# EAGLE design driver (EAGLE 6.5.0)
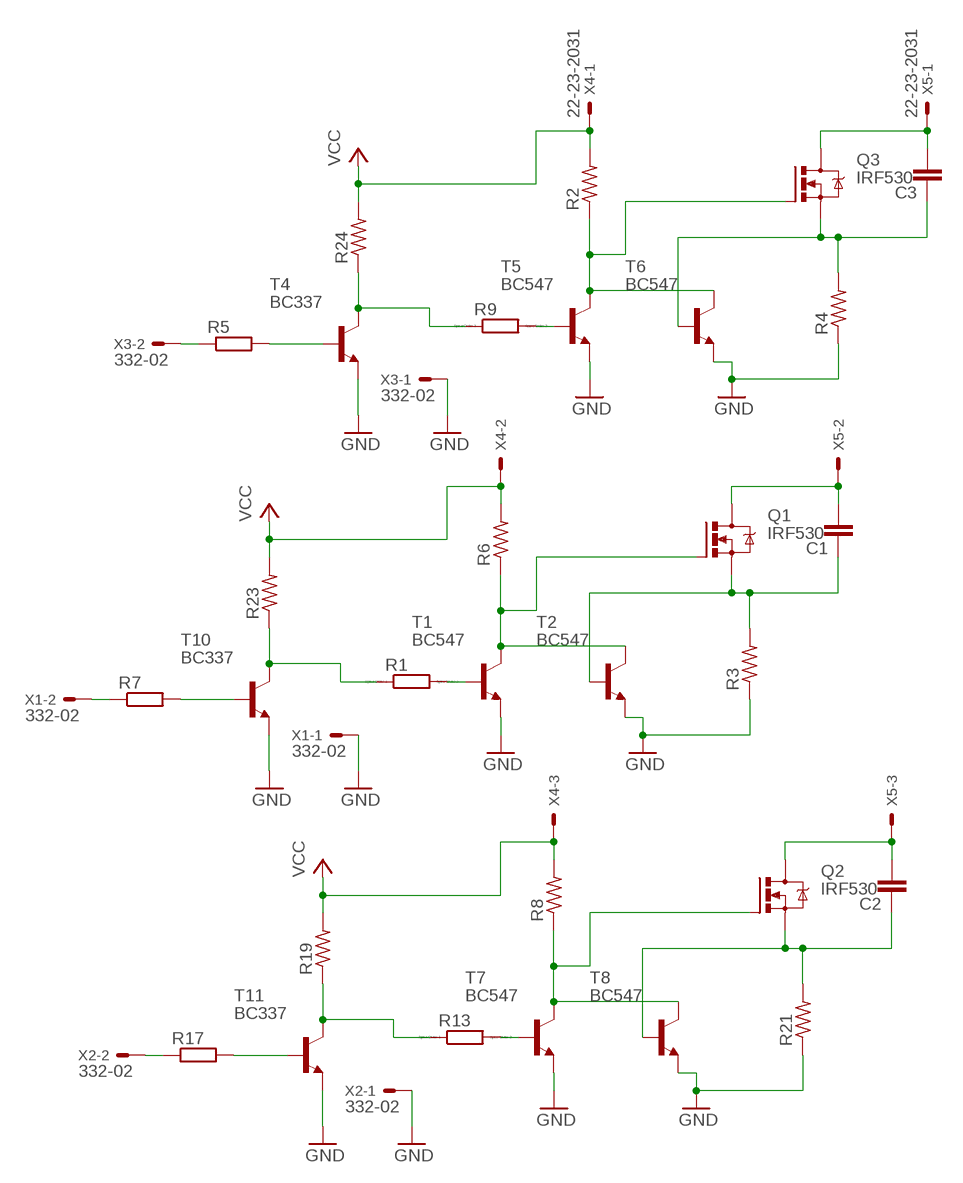
[diagram p0: schematic, sheet 1]

## Parts
C1  C-EU025-025X050  [C025-025X050]
C2  C-EU025-025X050  [C025-025X050]
C3  C-EU025-025X050  [C025-025X050]
Q1  IRF530  [TO220BV]
Q2  IRF530  [TO220BV]
Q3  IRF530  [TO220BV]
R1  R0204/7  [0204/7]
R2  R-US_0309/10  [0309/10]
R3  R-US_0817/22  [P0817/22]
R4  R-US_0817/22  [P0817/22]
R5  R-EU_0204/7  [0204/7]
R6  R-US_0309/10  [0309/10]
R7  R-EU_0204/7  [0204/7]
R8  R-US_0309/10  [0309/10]
R9  R0204/7  [0204/7]
R13  R0204/7  [0204/7]
R17  R-EU_0204/7  [0204/7]
R19  R-US_0309/10  [0309/10]
R21  R-US_0817/22  [P0817/22]
R23  R-US_0309/10  [0309/10]
R24  R-US_0309/10  [0309/10]
T1  BC547  [TO92]
T2  BC547  [TO92]
T4  BC337  [TO92]
T5  BC547  [TO92]
T6  BC547  [TO92]
T7  BC547  [TO92]
T8  BC547  [TO92]
T10  BC337  [TO92]
T11  BC337  [TO92]
X1  332-02  [332-02]
X2  332-02  [332-02]
X3  332-02  [332-02]
X4  22-23-2031  [22-23-2031]
X5  22-23-2031  [22-23-2031]

## Nets
GND: R3.1 R4.1 R21.1 T1.1(E) T2.1(E) T4.1(E) T5.1(E) T6.1(E) T7.1(E) T8.1(E) T10.1(E) T11.1(E) X1.1 X2.1 X3.1
N$1: R1.2 T1.2(B)
N$2: Q1.G R6.1 T1.3(C) T2.3(C)
N$3: C1.2 Q1.D X5.2
N$4: R5.2 T4.2(B)
N$5: C1.1 Q1.S R3.2 T2.2(B)
N$6: R7.2 T10.2(B)
N$7: R9.1 R24.1 T4.3(C)
N$8: R5.1 X3.2
N$9: R1.1 R23.1 T10.3(C)
N$10: R7.1 X1.2
N$11: R13.2 T7.2(B)
N$12: R9.2 T5.2(B)
N$13: Q3.G R2.1 T5.3(C) T6.3(C)
N$14: C3.2 Q3.D X5.1
N$15: C3.1 Q3.S R4.2 T6.2(B)
N$16: Q2.G R8.1 T7.3(C) T8.3(C)
N$17: C2.2 Q2.D X5.3
N$18: C2.1 Q2.S R21.2 T8.2(B)
N$19: R17.2 T11.2(B)
N$20: R13.1 R19.1 T11.3(C)
N$21: R17.1 X2.2
VCC: R2.2 R6.2 R8.2 R19.2 R23.2 R24.2 X4.1 X4.2 X4.3

## Library data of the parts
C1-C3 = rcl:C-EU: CAPACITOR, European symbol
Q1-Q3 = transistor-power:IRF530: HEXFET Power MOSFET
R1 R9 R13 = eagle-ltspice:R: RESISTOR, European symbol; SPICEMODEL: NONE; SPICEPREFIX: R
R2-R4 R6 R8 R19 R21 R23 R24 = resistor:R-US_: RESISTOR, American symbol
R5 R7 R17 = rcl:R-EU_: RESISTOR, European symbol
T1 T2 T5-T8 = transistor:BC547: NPN TRANSISTOR
T4 T10 T11 = transistor:BC337: NPN TRANSISTOR
X1-X3 = con-garry:332-02: 2 Pin - 2mm Dual Row Source: www.mpe-connector.de / garry_shortform_2012.pdf
X4 X5 = con-molex:22-23-2031: .100" (2.54mm) Center Header - 3 Pin; MF: MOLEX; MPN: 22-23-2031; OC_FARNELL: 1462950; OC_NEWARK: 30C0862

## Board
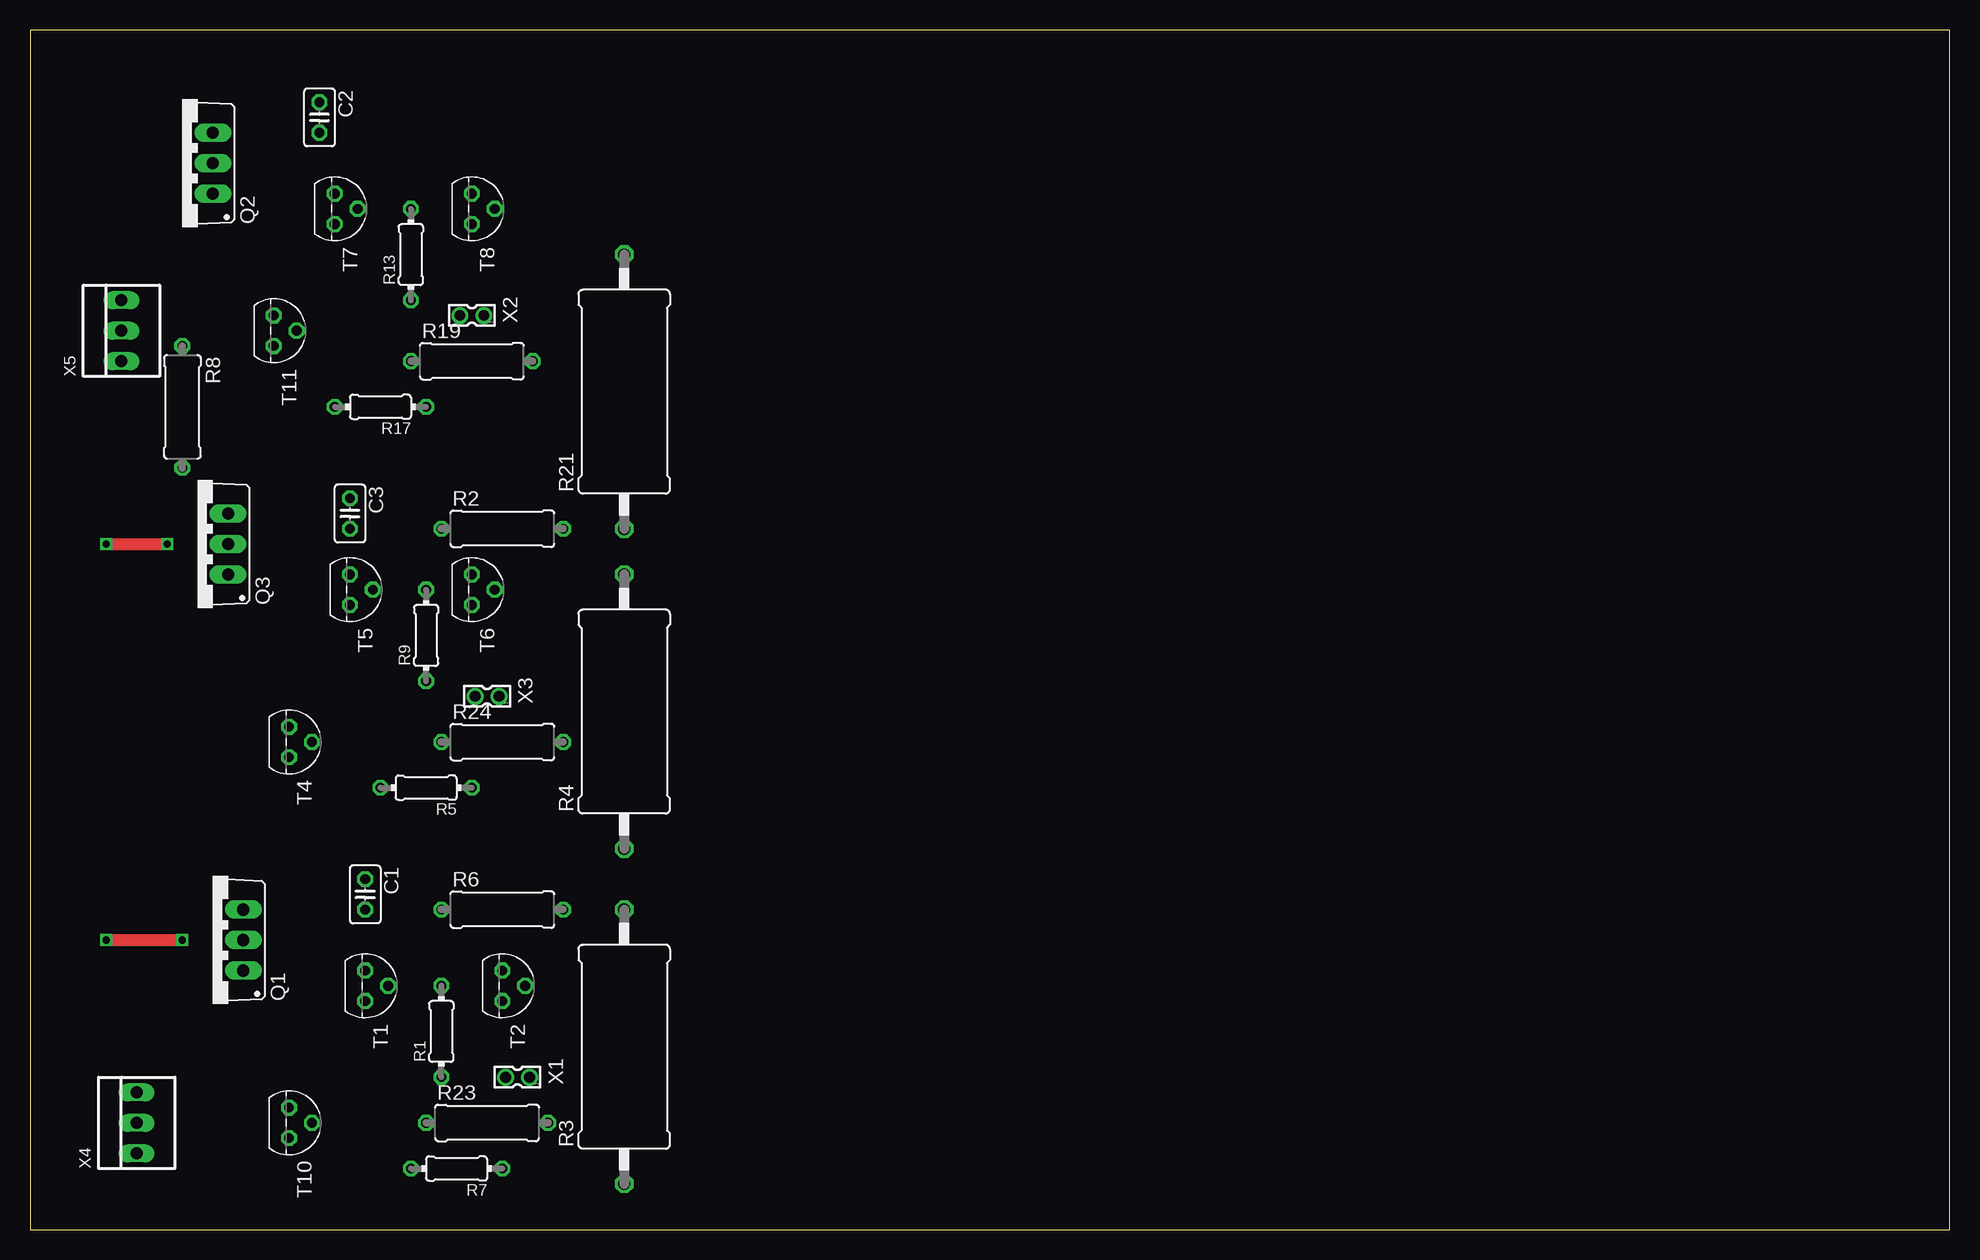
[diagram p1: board, top side]
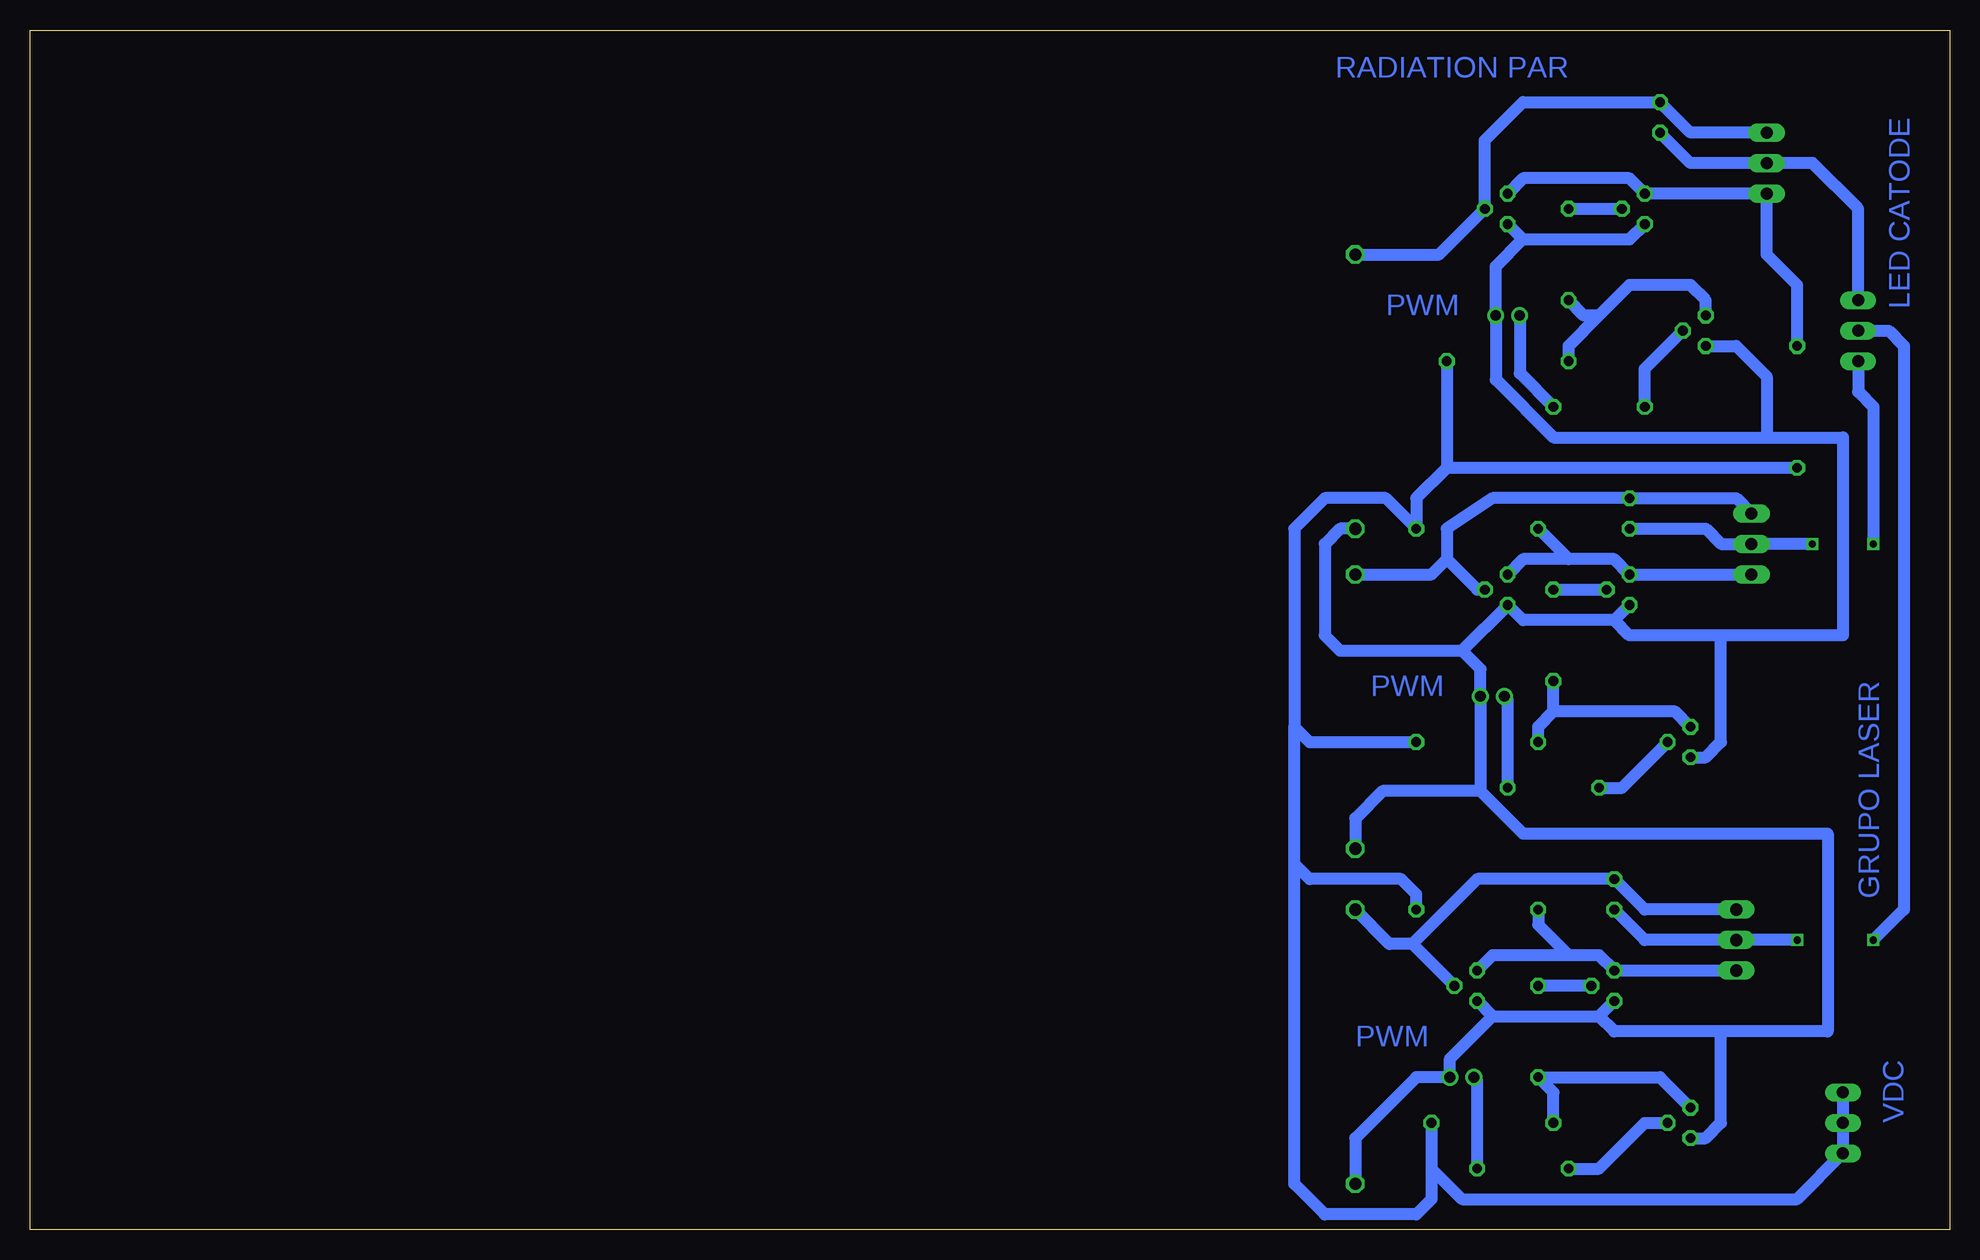
[diagram p2: board, bottom side, seen from below]

Size 160 x 100 mm. Coordinates in mm from the lower left corner, seen from the top.
Outline: 0,0 160,0 160,100 0,100 0,0
Copper layers (1*16): Top 0.035mm / dielectric 1.5mm / Bottom 0.035mm
Design rules "default": minimum track width 10mil, minimum drill 24mil, track to track 8mil, track to pad 8mil, pad to pad 8mil, via to via 8mil, smd to smd 8mil, copper to edge 40mil, drill to drill 8mil, minimum pad ring 10mil, minimum via ring 8mil, stop-mask expansion 4mil, vias tented up to drill 0mil, thermal gap 10mil

### Footprints (pad centres in the part's own frame; a part is rotated, then mirrored left to right if it is on the bottom)
C025-025X050 = drill 0.813 octagon: 1 -1.27,0; 2 1.27,0
TO220BV = drill 1.016 long: D 0,-2.54; G -2.54,-2.54; S 2.54,-2.54
0204/7 = drill 0.813 octagon: 1 -3.81,0; 2 3.81,0
0309/10 = drill 0.813 octagon: 1 -5.08,0; 2 5.08,0
P0817/22 = drill 1.016 octagon: 1 -11.43,0; 2 11.43,0
TO92 = drill 0.813 octagon: 1 1.27,0; 2 0,1.905; 3 -1.27,0
332-02 = drill 0.9 pad 1.27: 1 0,-1; 2 0,1
22-23-2031 = drill 1 long: 1 -2.54,0; 2 0,0; 3 2.54,0

### Placement (x,y rotation side)
C1  27.94,27.94 270 top
C2  24.13,92.71 270 top
C3  26.67,59.69 270 top
Q1  15.24,24.13 90 top
Q2  12.7,88.9 90 top
Q3  13.97,57.15 90 top
R1  34.29,16.51 90 top
R2  39.37,58.42 0 top
R3  49.53,15.24 90 top
R4  49.53,43.18 90 top
R5  33.02,36.83 180 top
R6  39.37,26.67 0 top
R7  35.56,5.08 180 top
R8  12.7,68.58 270 top
R9  33.02,49.53 90 top
R13  31.75,81.28 90 top
R17  29.21,68.58 180 top
R19  36.83,72.39 0 top
R21  49.53,69.85 90 top
R23  38.1,8.89 0 top
R24  39.37,40.64 0 top
T1  27.94,20.32 270 top
T2  39.37,20.32 270 top
T4  21.59,40.64 270 top
T5  26.67,53.34 270 top
T6  36.83,53.34 270 top
T7  25.4,85.09 270 top
T8  36.83,85.09 270 top
T10  21.59,8.89 270 top
T11  20.32,74.93 270 top
X1  40.64,12.7 90 top
X2  36.83,76.2 90 top
X3  38.1,44.45 90 top
X4  8.89,8.89 90 top
X5  7.62,74.93 90 top

### Tracks (layer width: path | path; a pad name or v marks a point on that pad's centre or on a via)
GND
  Bottom 1.016: T5.1 27.94,50.8 | 27.94,50.8 35.56,50.8 T6.1 40.64,48.26 | 40.64,48.26 39.1,46.72 X3.1 39.1,36.56 | 27.94,50.8 26.67,49.53 19.05,49.53 | T2.1 38.1,17.78 | 38.1,17.78 29.21,17.78 | 29.21,17.78 T1.1 | 29.21,17.78 27.94,16.51 19.05,16.51 | 39.1,36.56 35.56,33.02 10.16,33.02 10.16,16.51 19.05,16.51 | T8.1 35.56,82.55 | 35.56,82.55 26.67,82.55 T7.1 | 35.56,82.55 37.83,80.28 X2.1 37.83,70.85 33.02,66.04 15.24,66.04 | 15.24,66.04 8.89,66.04 8.89,49.53 19.05,49.53 | T10.1 20.32,7.62 19.05,8.89 19.05,16.51 | 38.1,17.78 41.64,14.24 X1.1 44.45,12.7 49.53,7.62 R3.1 | T4.1 20.32,39.37 19.05,40.64 19.05,49.53 | 39.1,36.56 47.26,36.56 49.53,34.29 R4.1 | T11.1 17.78,73.66 15.24,71.12 15.24,66.04 | R21.1 50.8,58.42 52.07,57.15 52.07,49.53 50.8,48.26 40.64,48.26
N$1
  Bottom 1.016: T1.2 R1.2
N$2
  Bottom 1.016: 31.75,22.86 29.21,22.86 T1.3 Q1.G | 31.75,22.86 38.1,22.86 T2.3 | R6.1 34.29,25.4 31.75,22.86
N$3  (via drill 0.6)
  Top 1.016: v6.35,24.13 v12.7,24.13
  Bottom 1.016: C1.2 25.4,24.13 Q1.D v12.7,24.13 | X5.2 5.08,74.93 3.81,73.66 3.81,26.67 v6.35,24.13
N$4
  Bottom 1.016: R5.2 27.3,36.83 T4.2
N$5
  Bottom 1.016: 44.77,23.81 T2.2 | Q1.S 25.4,26.67 C1.1 39.37,29.21 44.77,23.81 | 44.77,23.81 46.67,23.81 R3.2
N$6
  Bottom 1.016: R7.2 29.21,5.08 25.4,8.89 T10.2
N$7
  Bottom 1.016: R24.1 34.29,41.91 33.02,43.18 | 33.02,43.18 R9.1 | T4.3 22.86,43.18 33.02,43.18
N$8
  Bottom 1.016: R5.1 36.83,44.18 X3.2
N$9
  Bottom 1.016: R23.1 33.02,11.43 R1.1 24.13,12.7 T10.3
N$10
  Bottom 1.016: R7.1 39.37,12.43 X1.2
N$11
  Bottom 1.016: R13.2 T7.2
N$12
  Bottom 1.016: R9.2 T5.2
N$13
  Bottom 1.016: 31.75,55.88 27.94,55.88 T5.3 Q3.G | 31.75,55.88 35.56,55.88 T6.3 | R2.1 31.75,55.88
N$14  (via drill 0.6)
  Top 1.016: v6.35,57.15 v11.43,57.15
  Bottom 1.016: C3.2 20.32,58.42 19.05,57.15 Q3.D v11.43,57.15 | X5.1 7.62,69.85 6.35,68.58 v6.35,57.15
N$15
  Bottom 1.016: T6.2 39.37,53.34 41.91,55.88 | 41.91,55.88 41.91,58.42 38.1,60.96 C3.1 17.78,60.96 Q3.S | R4.2 43.18,54.61 41.91,55.88
N$16
  Bottom 1.016: T8.3 35.56,87.63 26.67,87.63 T7.3 Q2.G 15.24,81.28 12.7,78.74 R8.1
N$17
  Bottom 1.016: C2.2 21.59,88.9 Q2.D 11.43,88.9 7.62,85.09 X5.3
N$18
  Bottom 1.016: Q2.S 21.59,91.44 C2.1 35.56,93.98 38.73,90.81 T8.2 42.55,81.28 R21.2
N$19
  Bottom 1.016: R17.2 25.4,71.75 T11.2
N$20
  Bottom 1.016: R19.1 31.75,73.66 29.21,76.2 | 29.21,76.2 30.48,76.2 R13.1 | T11.3 20.32,77.47 21.59,78.74 26.67,78.74 29.21,76.2
N$21
  Bottom 1.016: X2.2 35.83,71.39 R17.1
VCC
  Bottom 1.016: R8.2 41.91,63.5 | 41.91,63.5 44.45,60.96 R2.2 46.99,60.96 52.07,60.96 54.61,58.42 54.61,41.91 | R19.2 41.91,63.5 | 54.61,41.91 53.34,40.64 R24.2 | R6.2 44.45,27.94 45.72,29.21 53.34,29.21 54.61,30.48 | 54.61,30.48 54.61,41.91 | 54.61,30.48 54.61,3.81 52.07,1.27 44.45,1.27 43.18,2.54 R23.2 43.18,5.08 40.64,2.54 12.7,2.54 X4.1 X4.2 X4.3

### Text on the board
Bottom: RADIATION PAR | LED CATODE | PWM | GRUPO LASER | PWM | PWM | VDC